# EAGLE design PCM2707 (EAGLE 6.5.0)
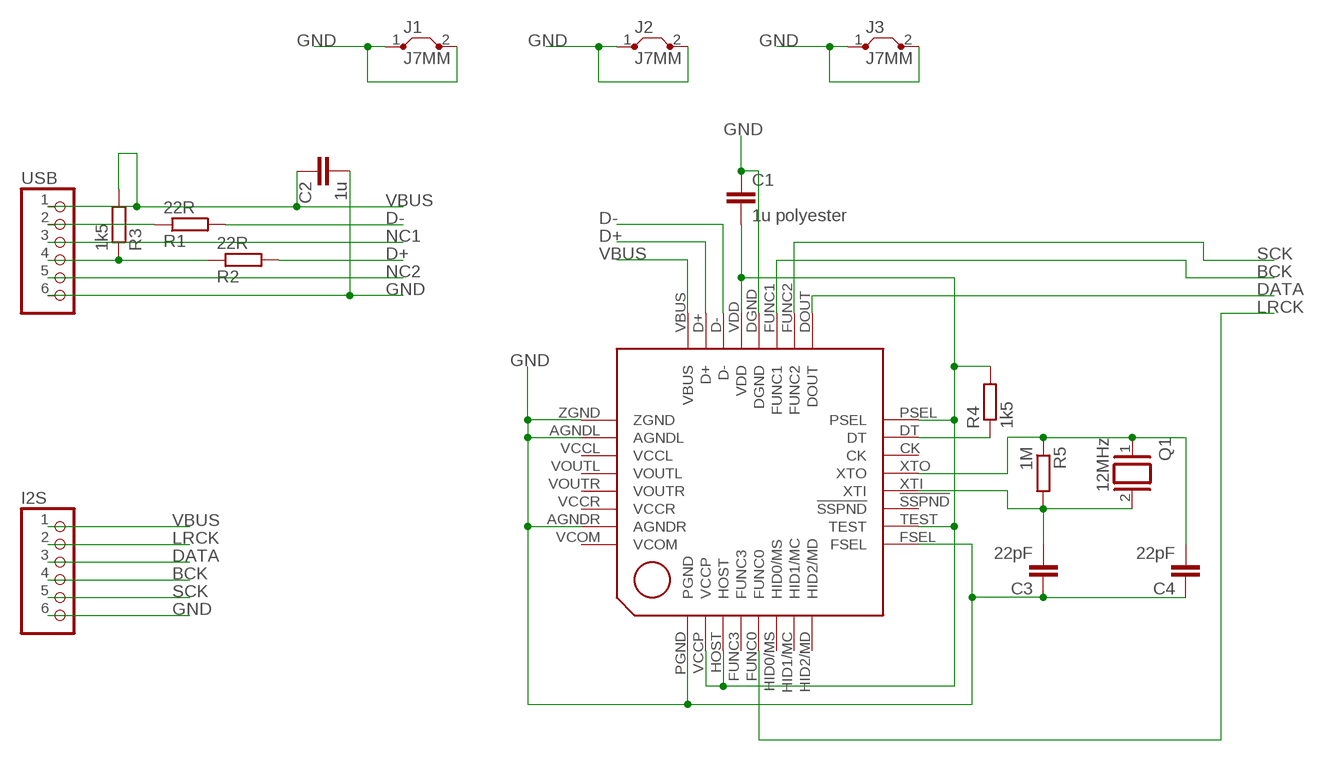
[diagram p0: schematic, sheet 1]

## Parts
C1  1u polyester  C5/4.5  [C5B4.5]
C2  1u  C5/3.5  [C5B3.5]
C3  22pF  C5/3.5  [C5B3.5]
C4  22pF  C5/3.5  [C5B3.5]
I2S  PINHD-1X6/90  [1X06/90]
J1  J7MM  [07]
J2  J7MM  [07]
J3  J7MM  [07]
Q1  12MHz  XTAL  [Q]
R1  22R  R-EU_0207/7  [0207/7]
R2  22R  R-EU_0207/7  [0207/7]
R3  1k5  R-EU_0207/7  [0207/7]
R4  1k5  R-EU_0207/7  [0207/7]
R5  1M  R-EU_0207/7  [0207/7]
U$1  PCM2706  [TQFP32-08]
USB  PINHD-1X6  [1X06]

## Nets
BCK: I2S.4 U$1.FUNC1
D+: R2.2 U$1.D+
D-: R1.2 U$1.D-
DATA: I2S.3 U$1.DOUT
GND: C1.1 C2.2 C3.1 C4.1 I2S.6 J1.1 J1.2 J2.1 J2.2 J3.1 J3.2 U$1.AGNDL U$1.AGNDR U$1.DGND U$1.FSEL U$1.PGND U$1.ZGND USB.6
LRCK: I2S.2 U$1.FUNC0
N$1: C1.2 R4.2 U$1.HOST U$1.PSEL U$1.TEST U$1.VCCP U$1.VDD
N$2: R4.1 U$1.DT
N$3: C4.2 Q1.1 R5.1 U$1.XTO
N$4: R2.1 R3.1 USB.4
N$6: C3.2 Q1.2 R5.2 U$1.XTI
N$16: R1.1 USB.2
NC1: USB.3
NC2: USB.5
SCK: I2S.5 U$1.FUNC2
VBUS: C2.1 I2S.1 R3.2 U$1.VBUS USB.1
Unconnected: U$1.!SSPND U$1.CK U$1.FUNC3 U$1.HID0/MS U$1.HID1/MC U$1.HID2/MD U$1.VOUTL U$1.VOUTR

## Power pins joined to a net without a drawn wire
VCCL: U$1.VCCL
VCCR: U$1.VCCR
VCOM: U$1.VCOM

## Library data of the parts
C1-C4 = capacitor-wima:C: CAPACITOR naming: grid - package width
I2S USB = pinhead:PINHD-1X6: PIN HEADER
J1-J3 = jumper:J: Bridge
Q1 = special:XTAL: CRYSTAL
R1-R5 = resistor:R-EU_: RESISTOR, European symbol
U$1 = pcm2706:PCM2706: Texas Instruments' Audio Dac.

## Board
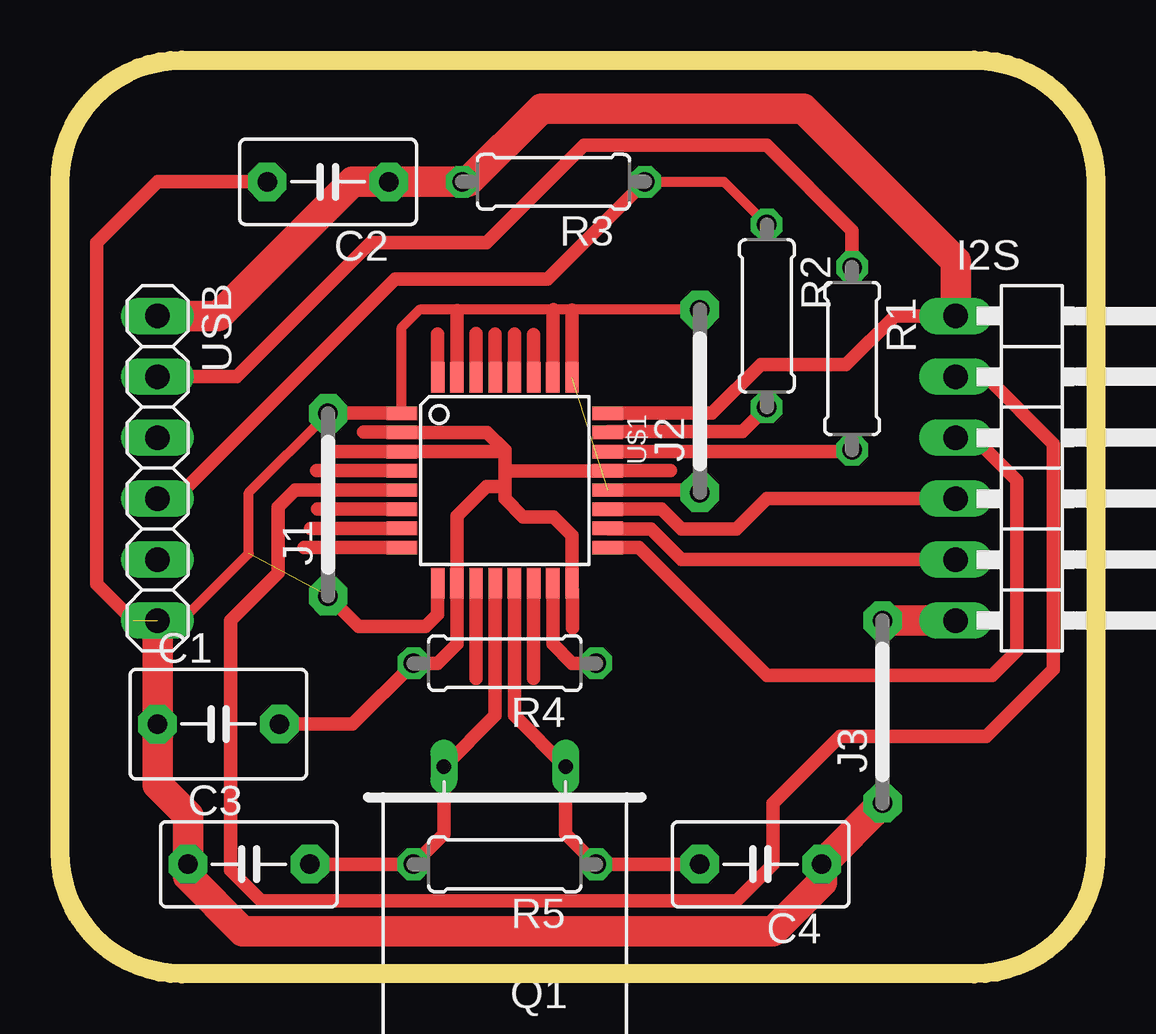
[diagram p1: board, top side]

Size 43.18 x 38.1 mm. Coordinates in mm from the lower left corner, seen from the top.
Outline: 5.08,38.1 38.1,38.1 arc-90 43.18,33.02 43.18,5.08 arc-90 38.1,0 5.08,0 arc-90 0,5.08 0,33.02 arc-90 5.08,38.1
Copper layers (1*16): Top 0.035mm / dielectric 1.5mm / Bottom 0.035mm
Design rules "default": minimum track width 10mil, minimum drill 24mil, track to track 8mil, track to pad 8mil, pad to pad 8mil, via to via 8mil, smd to smd 8mil, copper to edge 40mil, drill to drill 8mil, minimum pad ring 10mil, minimum via ring 8mil, stop-mask expansion 4mil, vias tented up to drill 0mil, thermal gap 10mil

### Footprints (pad centres in the part's own frame; a part is rotated, then mirrored left to right if it is on the bottom)
C5B4.5 = drill 0.813 pad 1.6 octagon: 1 -2.54,0; 2 2.54,0
C5B3.5 = drill 0.813 pad 1.6 octagon: 1 -2.54,0; 2 2.54,0
1X06/90 = drill 1.016 long: 1 -6.35,-3.81; 2 -3.81,-3.81; 3 -1.27,-3.81; 4 1.27,-3.81; 5 3.81,-3.81; 6 6.35,-3.81
07 = drill 0.813 pad 1.6 octagon: 1 -3.81,0; 2 3.81,0
Q = drill 0.61 long: 1 -2.54,-7.62; 2 2.54,-7.62
0207/7 = drill 0.813 octagon: 1 -3.81,0; 2 3.81,0
TQFP32-08 = smd 1.27 x 0.559: !SSPND 4.293,-1.2; AGNDL -4.293,2; AGNDR -4.293,-2; CK 4.293,1.2; DT 4.293,2; FSEL 4.293,-2.8; PSEL 4.293,2.8; TEST 4.293,-2; VCCL -4.293,1.2; VCCR -4.293,-1.2; VCOM -4.293,-2.8; VOUTL -4.293,0.4; VOUTR -4.293,-0.4; XTI 4.293,-0.4; XTO 4.293,0.4; ZGND -4.293,2.8 | smd 0.559 x 1.27: D+ -2,4.293; D- -1.2,4.293; DGND 0.4,4.293; DOUT 2.8,4.293; FUNC0 0.4,-4.293; FUNC1 1.2,4.293; FUNC2 2,4.293; FUNC3 -0.4,-4.293; HID0/MS 1.2,-4.293; HID1/MC 2,-4.293; HID2/MD 2.8,-4.293; HOST -1.2,-4.293; PGND -2.8,-4.293; VBUS -2.8,4.293; VCCP -2,-4.293; VDD -0.4,4.293
1X06 = drill 1.016 long: 1 -6.35,0; 2 -3.81,0; 3 -1.27,0; 4 1.27,0; 5 3.81,0; 6 6.35,0

### Placement (x,y rotation side)
C1  6.6,10.41 0 top
C2  11.18,33.02 180 top
C3  7.87,4.57 0 top
C4  29.21,4.57 180 top
I2S  41.15,21.08 270 top
J1  11.18,19.56 90 top
J2  26.67,23.88 90 top
J3  34.29,10.92 90 top
Q1  18.54,1.02 180 top
R1  33.02,25.65 270 top
R2  29.46,27.43 270 top
R3  20.57,33.02 180 top
R4  18.54,12.95 180 top
R5  18.54,4.57 180 top
U$1  18.54,20.57 270 top
USB  4.06,21.08 270 top

### Tracks (layer width: path | path; a pad name or v marks a point on that pad's centre or on a via)
BCK
  Top 0.559: U$1.FUNC1 25.08,19.37 25.91,18.54 28.19,18.54 29.46,19.81 I2S.4
D+
  Top 0.406: 22.87,22.61 U$1.D+
  Top 0.559: 22.87,22.61 28.45,22.61 R2.2
D-
  Top 0.559: U$1.D- 32.95,21.77 R1.2
DATA
  Top 0.559: U$1.DOUT 24.14,17.77 29.46,12.45 38.86,12.45 39.88,13.46 39.88,20.57 38.1,22.35 I2S.3
GND  (4 unrouted)
  Top 0.406: 15.72,16.26 U$1.FSEL | U$1.PGND 14.25,26.95 14.99,27.69 16.51,27.69 | J2.2 21.34,27.69 | 21.34,27.69 20.57,27.69 16.51,27.69 | 16.54,27.65 16.51,27.69 | 21.34,27.68 21.34,27.69 | USB.6 5.08,14.73 7.87,17.53 7.87,20.07 J1.2
  Top 0.559: U$1.AGNDR 16.54,27.65 | 21.34,27.68 U$1.ZGND | U$1.AGNDL 20.54,27.65 20.57,27.69 | U$1.PGND J1.2 | U$1.FSEL 15.74,14.98 15.24,14.48 12.45,14.48 J1.1 | U$1.DGND 26.56,20.17 J2.1 | 3.05,14.73 1.52,16.26 1.52,30.48 4.06,33.02 C2.2
  Top 1.27: J3.2 I2S.6 | J3.1 C4.1 31.75,3.81 29.72,1.78 7.62,1.78 5.33,4.06 C3.1 5.33,6.6 4.06,7.87 C1.1 USB.6
LRCK
  Top 0.559: U$1.FUNC0 9.81,20.17 9.09,19.46 9.09,16.71 7.11,14.73 7.11,4.32 8.38,3.05 28.19,3.05 29.72,4.57 29.72,7.11 32.51,9.91 38.61,9.91 41.4,12.7 41.4,22.1 38.61,24.89 I2S.2
N$1
  Top 0.559: U$1.VCCP 17.81,22.57 18.54,21.84 18.54,21.59 | 18.54,21.59 18.54,20.83 | U$1.HOST 18.36,21.77 18.54,21.59 | U$1.VDD 18.69,20.97 18.54,20.83 | U$1.PSEL 21.34,18.28 20.57,19.05 19.3,19.05 18.54,19.81 18.54,20.32 | 18.54,20.32 18.54,20.83 | 18.54,20.32 17.78,20.32 16.54,19.08 U$1.TEST 16.54,13.75 15.75,12.95 R4.2 12.19,10.41 C1.2
N$2
  Top 0.559: U$1.DT 20.54,13.75 21.34,12.95 R4.1
N$3
  Top 0.559: U$1.XTO 18.94,10.78 Q1.1 21.08,5.84 R5.1 C4.2
N$4
  Top 0.406: R3.1 27.69,33.02 R2.1
  Top 0.559: USB.4 4.83,19.81 13.97,28.96 20.32,28.96 R3.1
N$6
  Top 0.559: U$1.XTI 18.14,10.78 Q1.2 16,5.84 R5.2 C3.2
N$7
  Top 0.559: 15.75,25.15 15.75,26.67
N$8
  Top 0.559: 17.35,25.12 17.35,26.7
N$9
  Top 0.559: 18.14,25.12 18.14,26.67
N$10
  Top 0.559: 18.95,25.12 18.95,26.67
N$11
  Top 0.559: 19.74,25.12 19.74,26.64
N$12
  Top 0.559: 13.99,22.58 12.65,22.58
N$13
  Top 0.559: 13.99,21.77 11.28,21.77
N$14
  Top 0.559: 13.99,20.98 10.69,20.98
N$15
  Top 0.559: 13.99,19.38 10.74,19.38
N$16
  Top 0.559: USB.2 7.37,24.89 12.95,30.48 17.78,30.48 21.84,34.54 29.46,34.54 33.02,30.99 R1.1
N$17
  Top 0.559: 13.99,18.57 10.44,18.57
N$18
  Top 0.559: 13.99,17.78 10.19,17.78
N$19
  Top 0.559: 17.35,16 17.35,12.32
N$20
  Top 0.559: 19.74,16.03 19.74,12.32
N$21
  Top 0.559: 21.36,16 21.36,14.43
N$22
  Top 0.559: 23.11,20.98 25.45,20.98
SCK
  Top 0.406: 22.87,18.54 U$1.FUNC2
  Top 0.559: 22.87,18.54 24.64,18.54 25.91,17.27 I2S.5
VBUS
  Top 0.559: U$1.VBUS 27.18,23.37 29.21,25.4 32.77,25.4 34.8,27.43 I2S.1
  Top 1.27: USB.1 6.6,27.43 12.19,33.02 C2.1 R3.2 17.02,33.02 20.07,36.07 30.99,36.07 37.34,29.72 I2S.1